# Altium schematic sheet ArtFire (1).SchDoc: ArtFire
size OrCAD C; Organization: XB; Revision: V0.6; SheetNumber: 1; SheetTotal: 1; Email: qanpan.lo@gmail.com
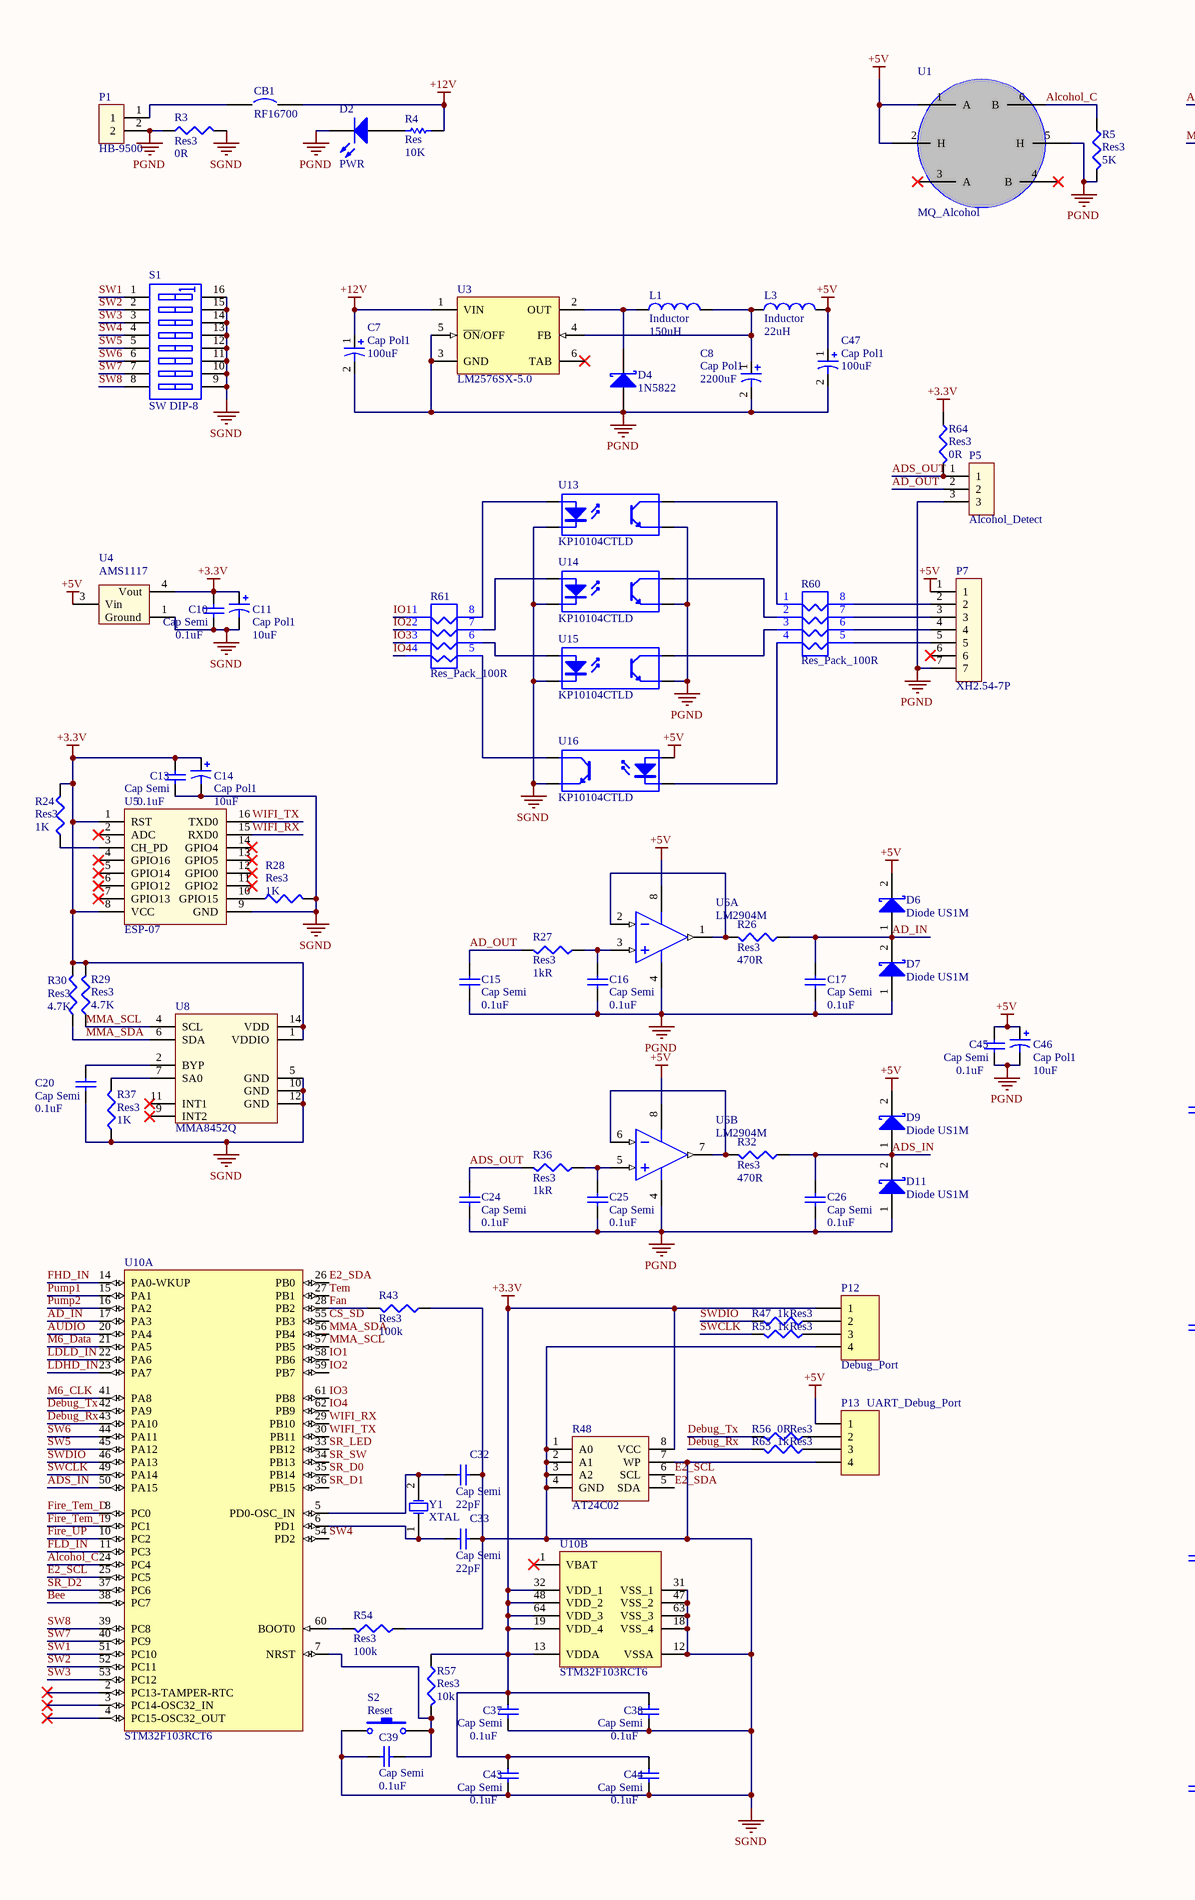
[diagram p0: ArtFire (1).SchDoc, left]
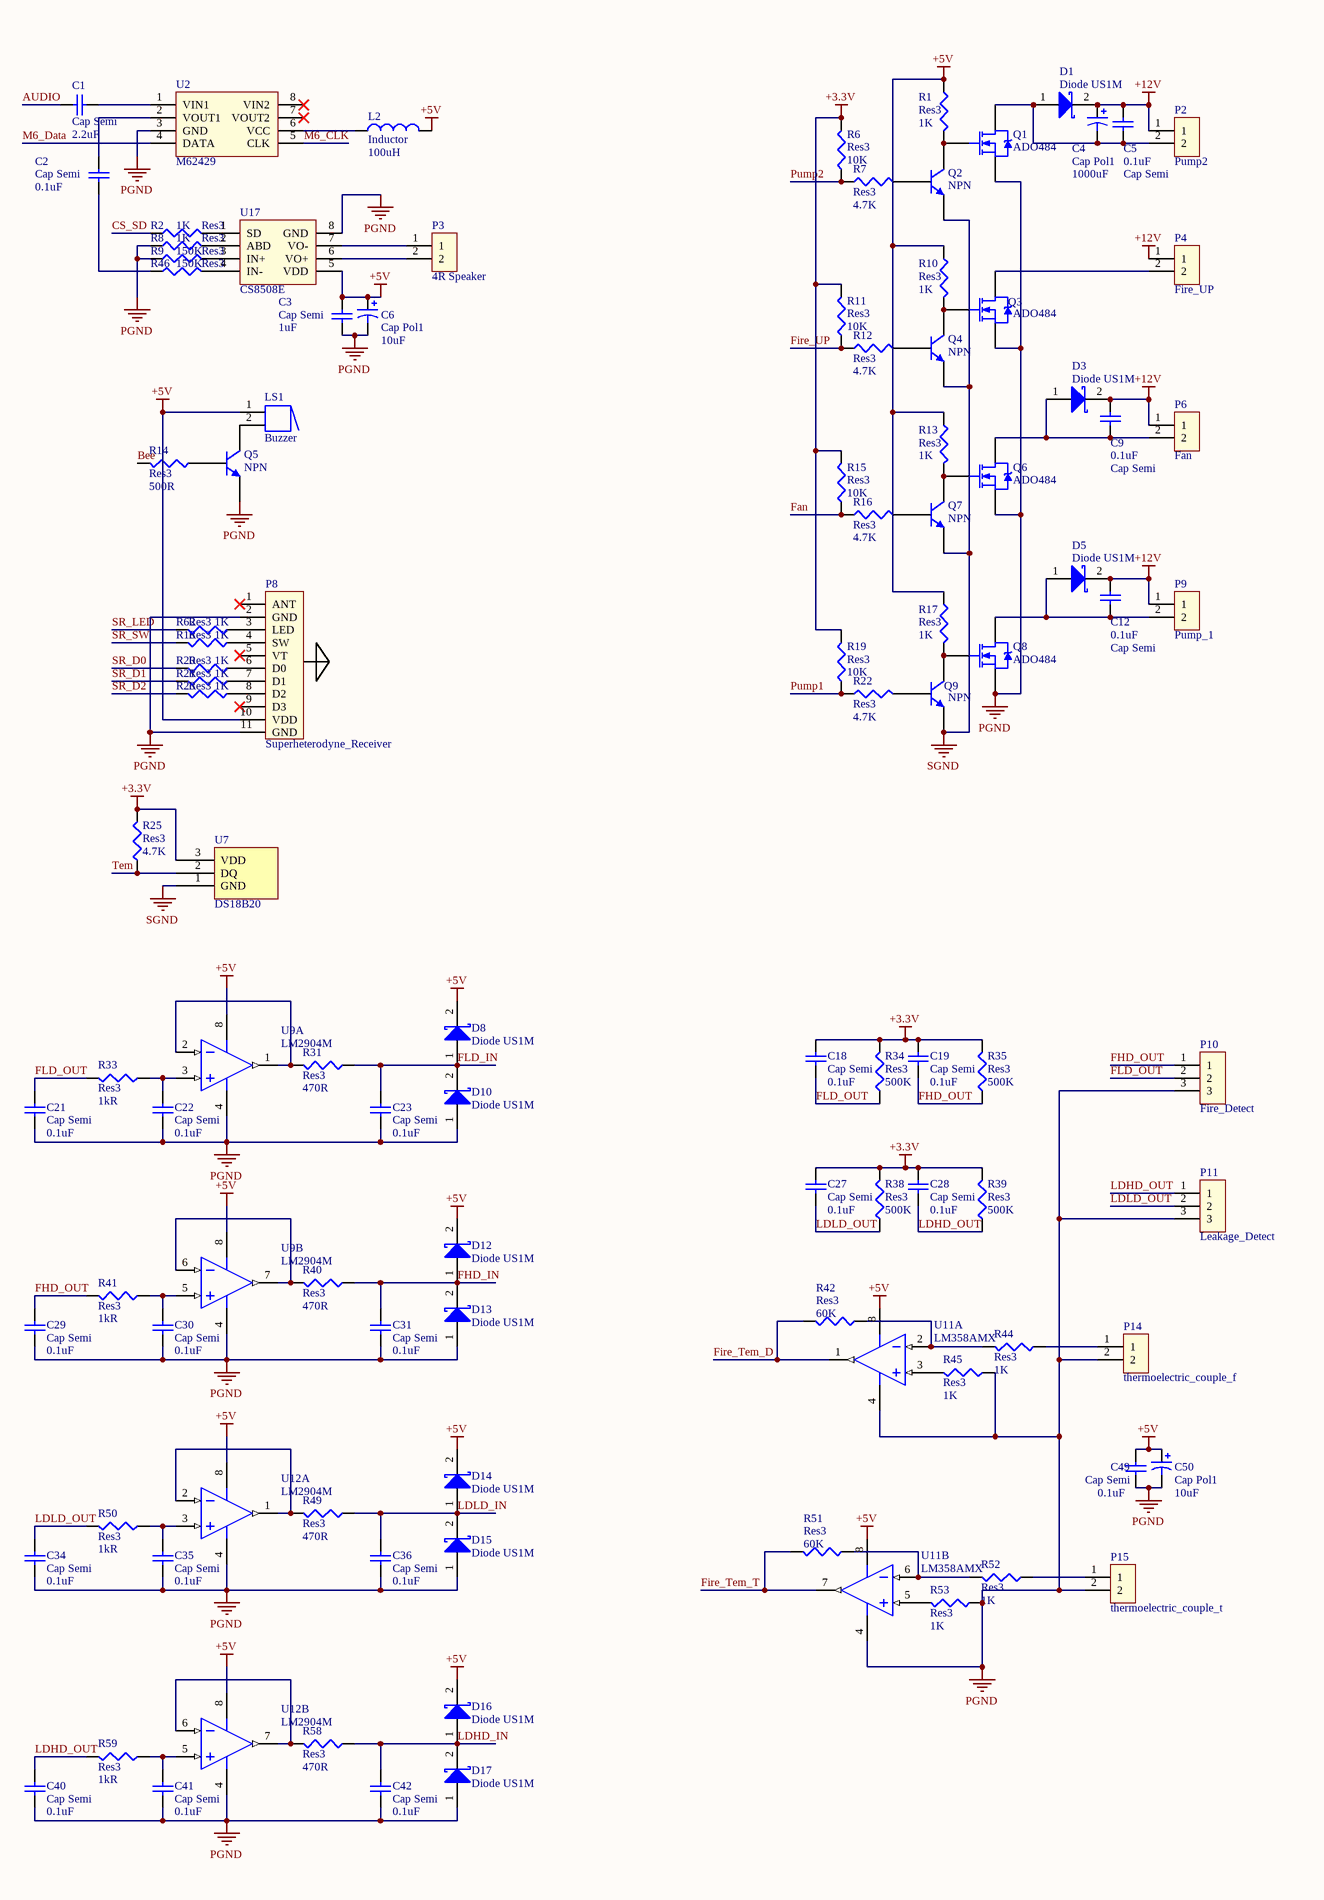
[diagram p1: ArtFire (1).SchDoc, right]

## Parts
C1  Cap Semi  value 2.2uF  [6-0805_N]
C2  Cap Semi  value 0.1uF  [6-0805_N]
C3  Cap Semi  value 1uF  [6-0805_N]
C4  Cap Pol1  value 1000uF  [CAP_10*10MM]
C5  Cap Semi  value 0.1uF  [6-0805_N]
C6  Cap Pol1  value 10uF  [Cap_5*4mm]
C7  Cap Pol1  value 100uF  [CAP_6.3*5.4MM]
C8  Cap Pol1  value 2200uF  [CAP10_17]
C9  Cap Semi  value 0.1uF  [6-0805_N]
C10  Cap Semi  value 0.1uF  [6-0805_N]
C11  Cap Pol1  value 10uF  [Cap_5*4mm]
C12  Cap Semi  value 0.1uF  [6-0805_N]
C13  Cap Semi  value 0.1uF  [6-0805_N]
C14  Cap Pol1  value 10uF  [Cap_5*4mm]
C15  Cap Semi  value 0.1uF  [6-0805_N]
C16  Cap Semi  value 0.1uF  [6-0805_N]
C17  Cap Semi  value 0.1uF  [6-0805_N]
C18  Cap Semi  value 0.1uF  [6-0805_N]
C19  Cap Semi  value 0.1uF  [6-0805_N]
C20  Cap Semi  value 0.1uF  [6-0805_N]
C21  Cap Semi  value 0.1uF  [6-0805_N]
C22  Cap Semi  value 0.1uF  [6-0805_N]
C23  Cap Semi  value 0.1uF  [6-0805_N]
C24  Cap Semi  value 0.1uF  [6-0805_N]
C25  Cap Semi  value 0.1uF  [6-0805_N]
C26  Cap Semi  value 0.1uF  [6-0805_N]
C27  Cap Semi  value 0.1uF  [6-0805_N]
C28  Cap Semi  value 0.1uF  [6-0805_N]
C29  Cap Semi  value 0.1uF  [6-0805_N]
C30  Cap Semi  value 0.1uF  [6-0805_N]
C31  Cap Semi  value 0.1uF  [6-0805_N]
C32  Cap Semi  value 22pF  [6-0805_N]
C33  Cap Semi  value 22pF  [6-0805_N]
C34  Cap Semi  value 0.1uF  [6-0805_N]
C35  Cap Semi  value 0.1uF  [6-0805_N]
C36  Cap Semi  value 0.1uF  [6-0805_N]
C37  Cap Semi  value 0.1uF  [6-0805_N]
C38  Cap Semi  value 0.1uF  [6-0805_N]
C39  Cap Semi  value 0.1uF  [6-0805_N]
C40  Cap Semi  value 0.1uF  [6-0805_N]
C41  Cap Semi  value 0.1uF  [6-0805_N]
C42  Cap Semi  value 0.1uF  [6-0805_N]
C43  Cap Semi  value 0.1uF  [6-0805_N]
C44  Cap Semi  value 0.1uF  [6-0805_N]
C45  Cap Semi  value 0.1uF  [6-0805_N]
C46  Cap Pol1  value 10uF  [Cap_5*4mm]
C47  Cap Pol1  value 100uF  [CAP_6.3*5.4MM]
C49  Cap Semi  value 0.1uF  [6-0805_N]
C50  Cap Pol1  value 10uF  [Cap_5*4mm]
CB1  RF16700  [SPST-2]
D1  Diode US1M  [US1M]
D2  PWR  [6-0805_N]
D3  Diode US1M  [US1M]
D4  1N5822  [US1M]
D5  Diode US1M  [US1M]
D6  Diode US1M  [US1M]
D7  Diode US1M  [US1M]
D8  Diode US1M  [US1M]
D9  Diode US1M  [US1M]
D10  Diode US1M  [US1M]
D11  Diode US1M  [US1M]
D12  Diode US1M  [US1M]
D13  Diode US1M  [US1M]
D14  Diode US1M  [US1M]
D15  Diode US1M  [US1M]
D16  Diode US1M  [US1M]
D17  Diode US1M  [US1M]
L1  Inductor  value 150uH  [CDRH127]
L2  Inductor  value 100uH  [6-0805_L]
L3  Inductor  value 22uH  [IND_0630]
LS1  Buzzer  [BUZZER]
P1  HB-9500  [HB-9500]
P2  Pump2  [CH3.96_2P]
P3  4R Speaker  [XH2.54-2P]
P4  Fire_UP  [KF7.62-2P]
P5  Alcohol_Detect  [XH2.54-3P]
P6  Fan  [XH2.54-2P]
P7  XH2.54-7P  [XH2.54-7P]
P8  Superheterodyne_Receiver  [Sperheterodyne_Receiver]
P9  Pump_1  [CH3.96_2P]
P10  Fire_Detect  [CH3.96_3P]
P11  Leakage_Detect  [XH2.54-3P]
P12  Debug_Port  [HDR1X4]
P13  UART_Debug_Port  [HDR1X4]
P14  thermoelectric_couple_f  [KF7.62-2P]
P15  thermoelectric_couple_t  [KF7.62-2P]
Q1  ADO484  [DPAK_AOD484]
Q2  NPN  [SOT-23_N]
Q3  ADO484  [DPAK_AOD484]
Q4  NPN  [SOT-23_N]
Q5  NPN  [SOT-23_N]
Q6  ADO484  [DPAK_AOD484]
Q7  NPN  [SOT-23_N]
Q8  ADO484  [DPAK_AOD484]
Q9  NPN  [SOT-23_N]
R1  Res3  value 1K  [6-0805_N]
R2  Res3  value 1K  [6-0805_N]
R3  Res3  value 0R  [6-0805_N]
R4  Res  value 10K  [6-0805_N]
R5  Res3  value 5K  [6-0805_N]
R6  Res3  value 10K  [6-0805_N]
R7  Res3  value 4.7K  [6-0805_N]
R8  Res3  value 1K  [6-0805_N]
R9  Res3  value 150K  [6-0805_N]
R10  Res3  value 1K  [6-0805_N]
R11  Res3  value 10K  [6-0805_N]
R12  Res3  value 4.7K  [6-0805_N]
R13  Res3  value 1K  [6-0805_N]
R14  Res3  value 500R  [6-0805_N]
R15  Res3  value 10K  [6-0805_N]
R16  Res3  value 4.7K  [6-0805_N]
R17  Res3  value 1K  [6-0805_N]
R18  Res3  value 1K  [6-0805_N]
R19  Res3  value 10K  [6-0805_N]
R20  Res3  value 1K  [6-0805_N]
R21  Res3  value 1K  [6-0805_N]
R22  Res3  value 4.7K  [6-0805_N]
R23  Res3  value 1K  [6-0805_N]
R24  Res3  value 1K  [6-0805_N]
R25  Res3  value 4.7K  [6-0805_N]
R26  Res3  value 470R  [6-0805_N]
R27  Res3  value 1kR  [6-0805_N]
R28  Res3  value 1K  [6-0805_N]
R29  Res3  value 4.7K  [6-0805_N]
R30  Res3  value 4.7K  [6-0805_N]
R31  Res3  value 470R  [6-0805_N]
R32  Res3  value 470R  [6-0805_N]
R33  Res3  value 1kR  [6-0805_N]
R34  Res3  value 500K  [6-0805_N]
R35  Res3  value 500K  [6-0805_N]
R36  Res3  value 1kR  [6-0805_N]
R37  Res3  value 1K  [6-0805_N]
R38  Res3  value 500K  [6-0805_N]
R39  Res3  value 500K  [6-0805_N]
R40  Res3  value 470R  [6-0805_N]
R41  Res3  value 1kR  [6-0805_N]
R42  Res3  value 60K  [6-0805_N]
R43  Res3  value 100k  [6-0805_N]
R44  Res3  value 1K  [6-0805_N]
R45  Res3  value 1K  [6-0805_N]
R46  Res3  value 150K  [6-0805_N]
R47  Res3  value 1k  [6-0805_N]
R48  AT24C02  [SOP8_TDA2822]
R49  Res3  value 470R  [6-0805_N]
R50  Res3  value 1kR  [6-0805_N]
R51  Res3  value 60K  [6-0805_N]
R52  Res3  value 1K  [6-0805_N]
R53  Res3  value 1K  [6-0805_N]
R54  Res3  value 100k  [6-0805_N]
R55  Res3  value 1k  [6-0805_N]
R56  Res3  value 0R  [6-0805_N]
R57  Res3  value 10k  [6-0805_N]
R58  Res3  value 470R  [6-0805_N]
R59  Res3  value 1kR  [6-0805_N]
R60  Res_Pack_100R  [Res_Pack_0603]
R61  Res_Pack_100R  [Res_Pack_0603]
R62  Res3  value 1K  [6-0805_N]
R63  Res3  value 1k  [6-0805_N]
R64  Res3  value 0R  [6-0805_N]
S1  SW DIP-8  [DHN(F)_8Pin]
S2  Reset  [SWP_PB_6.5mm]
U1  MQ_Alcohol  [MQ]
U2  M62429  [SO8_N]
U3  LM2576SX-5.0  [TS5B_L]
U4  AMS1117  [SOT223_N]
U5  ESP-07  [ESP-07_Wifi]
U6  LM2904M  [D0008A_M]  (parts A,B of 2)
U7  DS18B20  [TO-92A]
U8  MMA8452Q  [QFN-16]
U9  LM2904M  [D0008A_M]  (parts A,B of 2)
U10  STM32F103RCT6  [LQFP64_L]  (parts A,B of 2)
U11  LM358AMX  [M08A_M]  (parts A,B of 2)
U12  LM2904M  [D0008A_M]  (parts A,B of 2)
U13  KP10104CTLD  [KP10104CTLD]
U14  KP10104CTLD  [KP10104CTLD]
U15  KP10104CTLD  [KP10104CTLD]
U16  KP10104CTLD  [KP10104CTLD]
U17  CS8508E  [SO8_L]
Y1  XTAL  [OSC_5032_2Pin]

## Nets
+3.3V: C10.1 C11.1 C13.1 C14.1 C18.2 C19.2 C27.2 C28.2 C37.1 C38.1 C43.1 C44.1 P12.1 R6.2 R11.2 R15.2 R19.2 R24.2 R25.2 R29.2 R30.2 R34.2 R35.2 R38.2 R39.2 R48.8(VCC) R57.1 R64.1 U4.4(Vout) U5.1(RST) U5.8(VCC) U7.3(VDD) U8.1(VDDIO) U8.14(VDD) U10.13(VDDA) U10.19(VDD_4) U10.32(VDD_1) U10.48(VDD_2) U10.64(VDD_3)
+5V: C3.2 C6.1 C45.1 C46.1 C47.1 C49.1 C50.1 D6.2(K) D8.2(K) D9.2(K) D12.2(K) D14.2(K) D16.2(K) L2.2 L3.2 LS1.1 P7.1 P8.10(VDD) P13.1 R1.1 R10.1 R13.1 R17.1 U1.1(A) U1.2(H) U4.3(Vin) U6.8(V+) U9.8(V+) U11.8(V+) U12.8(V+) U16.1(A) U17.5(VDD)
+12V: C4.1 C5.1 C7.1 C9.1 C12.1 CB1.2 D1.2(K) D3.2(K) D5.2(K) P2.1 P4.1 P6.1 P9.1 R4.2 U3.1(VIN)
PGND: C3.1 C6.2 C7.2 C8.2 C15.1 C16.1 C17.1 C21.1 C22.1 C23.1 C24.1 C25.1 C26.1 C29.1 C30.1 C31.1 C34.1 C35.1 C36.1 C40.1 C41.1 C42.1 C45.2 C46.2 C47.2 C49.2 C50.2 D2.2(K) D4.1(A) D7.1(A) D10.1(A) D11.1(A) D13.1(A) D15.1(A) D17.1(A) P1.2 P5.3 P7.7 P8.2(GND) P8.11(GND) P10.3 P11.3 P14.2 P15.2 Q1.3(S) Q3.3(S) Q5.2(E) Q6.3(S) Q8.3(S) R3.1 R5.2 R8.1 R9.1 R45.1 R53.1 U1.5(H) U2.3(GND) U3.3(GND) U3.5(~{ON}/OFF) U6.4(GND) U9.4(GND) U11.4(GND) U12.4(GND) U13.3(E) U14.3(E) U15.3(E) U17.8(GND)
SGND: C10.2 C11.2 C13.2 C14.2 C20.1 C32.2 C33.2 C37.2 C38.2 C39.1 C43.2 C44.2 P12.4 P13.4 Q2.2(E) Q4.2(E) Q7.2(E) Q9.2(E) R3.2 R28.2 R37.1 R43.1 R48.1(A0) R48.2(A1) R48.3(A2) R48.4(GND) R48.7(WP) R54.1 S1.9(B8) S1.10(B7) S1.11(B6) S1.12(B5) S1.13(B4) S1.14(B3) S1.15(B2) S1.16(B1) S2.1 U4.1(Ground) U5.9(GND) U7.1(GND) U8.5(GND) U8.10(GND) U8.12(GND) U10.12(VSSA) U10.18(VSS_4) U10.31(VSS_1) U10.47(VSS_2) U10.63(VSS_3) U13.2(K) U14.2(K) U15.2(K) U16.3(E)
AD_IN: C17.2 D6.1(A) D7.2(K) R26.1 U10.17(PA3)
AD_OUT: C15.2 P5.2 R27.2
ADS_IN: C26.2 D9.1(A) D11.2(K) R32.1 U10.50(PA15)
ADS_OUT: C24.2 P5.1 R36.2 R64.2
Alcohol_C: R5.1 U1.6(B) U10.24(PC4)
AUDIO: C1.1 U10.20(PA4)
Bee: R14.2 U10.38(PC7)
CS_SD: R2.1 U10.55(PB3)
Debug_Rx: R63.2 U10.43(PA10)
Debug_Tx: R56.2 U10.42(PA9)
E2_SCL: R48.6(SCL) U10.25(PC5)
E2_SDA: R48.5(SDA) U10.26(PB0)
Fan: R15.1 R16.1 R43.2 U10.28(PB2)
FHD_IN: C31.2 D12.1(A) D13.2(K) R40.1 U10.14(PA0-WKUP)
FHD_OUT: C19.1 C29.2 P10.1 R35.1 R41.2
Fire_Tem_D: R42.2 U10.8(PC0) U11.1(OUTA)
Fire_Tem_T: R51.2 U10.9(PC1) U11.7(OUTB)
Fire_UP: R11.1 R12.1 U10.10(PC2)
FLD_IN: C23.2 D8.1(A) D10.2(K) R31.1 U10.11(PC3)
FLD_OUT: C18.1 C21.2 P10.2 R33.2 R34.1
IO1: R61.1 U10.58(PB6)
IO2: R61.2 U10.59(PB7)
IO3: R61.3 U10.61(PB8)
IO4: R61.4 U10.62(PB9)
LDHD_IN: C42.2 D16.1(A) D17.2(K) R58.1 U10.23(PA7)
LDHD_OUT: C28.1 C40.2 P11.1 R39.1 R59.2
LDLD_IN: C36.2 D14.1(A) D15.2(K) R49.1 U10.22(PA6)
LDLD_OUT: C27.1 C34.2 P11.2 R38.1 R50.2
M6_CLK: U2.5(CLK) U10.41(PA8)
M6_Data: U2.4(DATA) U10.21(PA5)
MMA_SCL: R29.1 U8.4(SCL) U10.57(PB5)
MMA_SDA: R30.1 U8.6(SDA) U10.56(PB4)
Pump1: R19.1 R22.1 U10.15(PA1)
Pump2: R6.1 R7.1 U10.16(PA2)
SR_D0: R20.2 U10.35(PB14)
SR_D1: R21.2 U10.36(PB15)
SR_D2: R23.2 U10.37(PC6)
SR_LED: R62.2 U10.33(PB12)
SR_SW: R18.2 U10.34(PB13)
SW1: S1.1(A1) U10.51(PC10)
SW2: S1.2(A2) U10.52(PC11)
SW3: S1.3(A3) U10.53(PC12)
SW4: S1.4(A4) U10.54(PD2)
SW5: S1.5(A5) U10.45(PA12)
SW6: S1.6(A6) U10.44(PA11)
SW7: S1.7(A7) U10.40(PC9)
SW8: S1.8(A8) U10.39(PC8)
SWCLK: R55.2 U10.49(PA14)
SWDIO: R47.2 U10.46(PA13)
Tem: R25.1 U7.2(DQ) U10.27(PB1)
WIFI_RX: U5.15(RXD0) U10.29(PB10)
WIFI_TX: U5.16(TXD0) U10.30(PB11)
NetC1_2: C1.2 U2.1(VIN1)
NetC2_1: C2.1 R46.1
NetC2_2: C2.2 U2.2(VOUT1)
NetC4_2: C4.2 C5.2 D1.1(A) P2.2 Q1.2(D)
NetC8_1: C8.1 L1.2 L3.1 U3.4(FB)
NetC9_2: C9.2 D3.1(A) P6.2 Q6.2(D)
NetC12_2: C12.2 D5.1(A) P9.2 Q8.2(D)
NetC16_2: C16.2 R27.1 U6.3(INA+)
NetC20_2: C20.2 U8.2(BYP)
NetC22_2: C22.2 R33.1 U9.3(INA+)
NetC25_2: C25.2 R36.1 U6.5(INB+)
NetC30_2: C30.2 R41.1 U9.5(INB+)
NetC32_1: C32.1 U10.5(PD0-OSC_IN) Y1.2(OSC2)
NetC33_1: C33.1 U10.6(PD1) Y1.1(OSC1)
NetC35_2: C35.2 R50.1 U12.3(INA+)
NetC39_2: C39.2 R57.2 S2.2 U10.7(NRST)
NetC41_2: C41.2 R59.1 U12.5(INB+)
NetCB1_1: CB1.1 P1.1
NetD2_1: D2.1(A) R4.1
NetD4_2: D4.2(K) L1.1 U3.2(OUT)
NetL2_1: L2.1 U2.6(VCC)
NetLS1_2: LS1.2 Q5.3(C)
NetP3_1: P3.1 U17.7(VO-)
NetP3_2: P3.2 U17.6(VO+)
NetP4_2: P4.2 Q3.2(D)
NetP7_2: P7.2 R60.8
NetP7_3: P7.3 R60.7
NetP7_4: P7.4 R60.6
NetP7_5: P7.5 R60.5
NetP8_3: P8.3(LED) R62.1
NetP8_4: P8.4(SW) R18.1
NetP8_6: P8.6(D0) R20.1
NetP8_7: P8.7(D1) R21.1
NetP8_8: P8.8(D2) R23.1
NetP12_2: P12.2 R47.1
NetP12_3: P12.3 R55.1
NetP13_2: P13.2 R56.1
NetP13_3: P13.3 R63.1
NetP14_1: P14.1 R44.1
NetP15_1: P15.1 R52.1
NetQ1_1: Q1.1(G) Q2.3(C) R1.2
NetQ2_1: Q2.1(B) R7.2
NetQ3_1: Q3.1(G) Q4.3(C) R10.2
NetQ4_1: Q4.1(B) R12.2
NetQ5_1: Q5.1(B) R14.1
NetQ6_1: Q6.1(G) Q7.3(C) R13.2
NetQ7_1: Q7.1(B) R16.2
NetQ8_1: Q8.1(G) Q9.3(C) R17.2
NetQ9_1: Q9.1(B) R22.2
NetR2_2: R2.2 U17.1(SD)
NetR8_2: R8.2 U17.2(ABD)
NetR9_2: R9.2 U17.3(IN+)
NetR24_1: R24.1 U5.3(CH_PD)
NetR26_2: R26.2 U6.1(OUTA) U6.2(INA-)
NetR28_1: R28.1 U5.10(GPIO15)
NetR31_2: R31.2 U9.1(OUTA) U9.2(INA-)
NetR32_2: R32.2 U6.6(INB-) U6.7(OUTB)
NetR37_2: R37.2 U8.7(SA0)
NetR40_2: R40.2 U9.6(INB-) U9.7(OUTB)
NetR42_1: R42.1 R44.2 U11.2(INA-)
NetR45_2: R45.2 U11.3(INA+)
NetR46_2: R46.2 U17.4(IN-)
NetR49_2: R49.2 U12.1(OUTA) U12.2(INA-)
NetR51_1: R51.1 R52.2 U11.6(INB-)
NetR53_2: R53.2 U11.5(INB+)
NetR54_2: R54.2 U10.60(BOOT0)
NetR58_2: R58.2 U12.6(INB-) U12.7(OUTB)
NetR60_1: R60.1 U13.4(C)
NetR60_2: R60.2 U14.4(C)
NetR60_3: R60.3 U15.4(C)
NetR60_4: R60.4 U16.2(K)
NetR61_5: R61.5 U16.4(C)
NetR61_6: R61.6 U15.1(A)
NetR61_7: R61.7 U14.1(A)
NetR61_8: R61.8 U13.1(A)

Not connected (* = marked no-connect by the designer): P7 6*; P8 1(ANT)* 5(VT)* 9(D3)*; U1 3(A)* 4(B)*; U2 7(VOUT2)* 8(VIN2)*; U3 6(TAB)*; U5 2(ADC)* 4(GPIO16)* 5(GPIO14)* 6(GPIO12)* 7(GPIO13)* 11(GPIO2)* 12(GPIO0)* 13(GPIO5)* 14(GPIO4)*; U8 3(NC) 8(NC) 9(INT2)* 11(INT1)* 13(NC) 15(NC) 16(NC); U10 1(VBAT)* 2(PC13-TAMPER-RTC)* 3(PC14-OSC32_IN)* 4(PC15-OSC32_OUT)*

## Notes on the sheet
- Title
- Size:
- Date:
- File:
- Orcad C
- Number:
- Time:
- Revision:
- Sheet
- of

## Library data of the parts
C1-C3 C5 C9 C10 C12 C13 C15-C45 C49 = Cap Semi: Capacitor (Semiconductor SIM Model); Published: 8-Jun-2000; LatestRevisionDate: 29-May-2009; LatestRevisionNote: IPC-7351 Footprint Added.; PackageReference: C1206; Publisher: Altium Limited; PackageDescription: Chip Capacitor
C4 C6-C8 C11 C14 C46 C47 C50 = Cap Pol1: Polarized Capacitor (Radial); Published: 8-Jun-2000; LatestRevisionDate: 17-Jul-2002; LatestRevisionNote: Re-released for DXP Platform.; PackageReference: RB7.6-15; Publisher: Altium Limited; PackageDescription: Polarized Capacitor (Radial); 2 Leads
CB1 = Circuit Breaker: Published: 24-Mar-1999; LatestRevisionDate: 17-Jul-2002; LatestRevisionNote: Re-released for DXP Platform.; PackageReference: SPST-2; Publisher: Altium Limited; PackageDescription: Switch; 2 Leads
D1 D3-D17 = Diode BAT17: Silicon RF Schottky Diode for Mixer Applications in the VHF/UHF Range; Note: Pin 2 is not connected and not drawn.; Published: 21-Mar-2003; LatestRevisionDate: 29-May-2009; LatestRevisionNote: IPC-7351 Footprint Added.; DatasheetVersion: Oct-1999; PackageVersion: Sep-2001; PackageReference: SOT-23; Publisher: Altium Limited; PackageDescription: 3-Pin SOT-23 Package 0.95 mm Pitch, 2.5 mm Lead Span; ComponentLink1Description: Manufacturer Link; ComponentLink1URL: http://www.infineon.com/; ComponentLink2Description: Datasheet; ComponentLink2URL: http://www.infineon.com/upload/Document/cmc_upload/documents/009/363/bat17series.pdf
D2 = LED0: Typical INFRARED GaAs LED; Published: 8-Jun-2000; LatestRevisionDate: 08-Jul-2005; LatestRevisionNote: Mech Layer 1 removed.; PackageReference: LED-0; Publisher: Altium Limited; PackageDescription: LED; 2 Leads
L1-L3 = Inductor: Code_IEC: 1005; Published: 8-Jun-2000; LatestRevisionDate: 29-May-2009; LatestRevisionNote: IPC-7351 Footprint Added.; PackageReference: 0402-A; Publisher: Altium Limited; PackageDescription: Chip Inductor; Code_JEITA: 0402
LS1 = Buzzer: Magnetic Transducer Buzzer; Published: 24-Mar-1999; LatestRevisionDate: 17-Dec-2003; LatestRevisionNote: Schematic revised, PCB Footprint replaced.; DatasheetVersion: 17-Dec-2003; PackageReference: ABSM-1574; Publisher: Altium Limited; PackageDescription: Magnetic Transducer Buzzer; ComponentLink1Description: Manufacturer Link; ComponentLink1URL: http://www.megastar.com/linecard/buzzmode/index.php
P1 = HB-9500: High current connector
P2 P9 = CH3.96_2P
P3 P6 = XH2.54-2P
P4 P14 P15 = KF3.96
P5 P11 = XH2.54-3P
P10 = CH3.96_3P
P12 P13 = Header 4: Header, 4-Pin; LatestRevisionDate: 17-Jul-2002; LatestRevisionNote: Re-released for DXP Platform.; Publisher: Altium Limited
Q1 Q3 Q6 Q8 = NMOS-2: N-Channel Power MOSFET; Note: Pin 2 is electrically connected to pin 4.; Published: 8-Jun-2000; LatestRevisionDate: 17-Jul-2002; LatestRevisionNote: Re-released for DXP Platform.; DatasheetVersion: PD-9.814; PackageVersion: Feb-1997; PackageReference: TO-220AB; Publisher: Altium Limited; PackageDescription: TO, Thru-Hole, Vertical, Heatsink Mounted; 3 In-Line Leads; Pitch 2.54 mm; ComponentLink1Description: Manufacturer Link; ComponentLink1URL: http://www.irf.com/
Q2 Q4 Q5 Q7 Q9 = NPN: NPN Bipolar Transistor; Published: 8-Jun-2000; LatestRevisionDate: 17-Jul-2002; LatestRevisionNote: Re-released for DXP Platform.; PackageReference: TO-226-AA; Publisher: Altium Limited; PackageDescription: TO, Flat Index; 3 In-Line, Axial Leads; Body Dia. 4.8mm; Leads 0.55 x 0.51 mm (max); Code_JEDEC: TO-226-AA
R1-R3 R5-R47 R49-R59 R62-R64 = Res3: Resistor; Published: 8-Jun-2000; LatestRevisionDate: 29-May-2009; LatestRevisionNote: IPC-7351 Footprint Added.; PackageReference: J1-0603; Publisher: Altium Limited; PackageDescription: Chip Resistor
R4 = Res1: Resistor; Published: 8-Jun-2000; LatestRevisionDate: 17-Jul-2002; LatestRevisionNote: Re-released for DXP Platform.; PackageReference: AXIAL-0.3; Publisher: Altium Limited; PackageDescription: Axial Device, Thru-Hole; 2 Leads; 0.3 in Pin Spacing
R60 R61 = Res_Pack_4
S1 = SW DIP-8: DIP Switch, 8 Position, SPST; Published: 24-Mar-1999; LatestRevisionDate: 17-Jul-2002; LatestRevisionNote: Re-released for DXP Platform.; PackageReference: DIP_SW_8WAY_SMD; Publisher: Altium Limited; PackageDescription: DIP Switch; 16 Leads
S2 = SW-PB: Switch; Published: 24-Mar-1999; LatestRevisionDate: 17-Jul-2002; LatestRevisionNote: Re-released for DXP Platform.; PackageReference: SPST-2; Publisher: Altium Limited; PackageDescription: Switch; 2 Leads
U1 = MQ
U2 = M62429: Digital Adjust Res
U3 = CMP-0069-00116-2: SIMPLE SWITCHER® 3A Step-Down Voltage Regulator, 5-pin TO-263; Manufacturer: National Semiconductor; PackageTopMarking: NSUZXYTTE#*LM2576S*-5.0 P+; PowerWise: N; ComponentLink2Description: LM2576 Web Page; Code_JEDEC: MO-169-AB; ComponentLink3Description: TS5B Package Page; PinCount: 5; RoHS: N; PackageReference: TS5B; ComponentLink1Description: LM2576 Datasheet; RevisionNote: Component URLs added; DatasheetVersion: Aug-2004; ComponentLink3URL: http://www.national.com/packaging/folders/ts5b.html; PackageVersion: revD, Apr-2005; ComponentLink2URL: http://www.national.com/pf/LM/LM2576.html; ComponentLink1URL: http://www.national.com/ds/LM/LM2576.pdf; PackageDescription: TO-263, Molded, .400 x .390 x .180in, 5 Lead, .067in Pitch, Surface Mount; CompType: Switcher
U5 = ESP-07_Wifi
U6 U9 U12 = CMP-0055-00776-3: Low Power Dual Operational Amplifier, 8-pin Narrow SOIC; Manufacturer: Texas Instruments; PackageTopMarking: NSZXTT*LM*2904M; CompType: Amplifiers; PowerWise: N; PackageDescription: SOIC Narrow, 4.9 x 3.9 x 1.45mm, 8 Lead, 1.27mm Pitch; ComponentLink1Description: Datasheet URL; PinCount: 8; Code_JEDEC: MS-012-AA; RoHS: N; Package Reference: D0008A; ComponentLink1URL: http://www.ti.com/general/docs/lit/getliterature.tsp?genericPartNumber=LM2904-N&fileType=pdf; Code_IPC: SOIC127P600-8
U10 = CMP-0237-00161-1: STM32 ARM-based 32-bit MCU Performance Line with 128 kB Flash, 20 kB Internal RAM, -40 to +105°C Temperature, 64-Pin LQFP, Tray; ComponentLink2Description: STM32 Family Web Page; ComponentLink1URL: http://www.st.com/internet/com/TECHNICAL_RESOURCES/TECHNICAL_LITERATURE/DATASHEET/CD00161566.pdf; ComponentLink3URL: http://www.st.com/internet/com/home/home.jsp; ComponentLink1Description: STM32F103 Datasheet; PackageVersion: rev13, Apr-2011; ComponentLink2URL: www.st.com/stm32; ComponentLink3Description: st.com Home; PackageDescription: 64-Pin Low-Profile Quad Flat Pack, 10 x 10 mm Body, 0.5 mm Pitch (LQFP64); DatasheetVersion: rev13.0, Apr-2011; PackageReference: LQFP64
U11 = CMP-0055-00768-2: Low Power Dual Operational Amplifier, 8-pin Narrow SOIC; Manufacturer: National Semiconductor; PowerWise: N; PackageTopMarking: NSZXTT*LM*358AM; CompType: Amplifiers; ComponentLink2Description: LM358 Web Page; ComponentLink3Description: M08A Package Page; ComponentLink1Description: LM358 Datasheet; PackageReference: M08A; ComponentLink2URL: http://www.national.com/pf/LM/LM358.html; ComponentLink3URL: http://www.national.com/packaging/folders/m08a.html; PackageDescription: SOIC Narrow, 4.9 x 3.9 x 1.45mm, 8 Lead, 1.27mm Pitch; PinCount: 8; DatasheetVersion: Oct-2005; ComponentLink1URL: http://www.national.com/ds/LM/LM358.pdf; RevisionNote: Component URLs added; RoHS: N; Code_JEDEC: MS-012-AA; PackageVersion: revM, May-2009; Code_IPC: SOIC127P600-8
U13-U16 = Optoisolator1: 4-Pin Phototransistor Optocoupler; Published: 24-Mar-1999; LatestRevisionDate: 04-Mar-2005; LatestRevisionNote: Sch pins 3 & 4 Swapped.; DatasheetVersion: Nov-2003; PackageReference: DIP-4; Publisher: Altium Limited
U17 = CS8508E: Audio Amplifier
Y1 = XTAL: Crystal Oscillator; Published: 8-Jun-2000; LatestRevisionDate: 17-Jul-2002; LatestRevisionNote: Re-released for DXP Platform.; PackageReference: R38; Publisher: Altium Limited; PackageDescription: Crystal, Thru-Hole; 2 Leads; Body 3.1 x 8.2 mm (Dia.xH)